# EAGLE schematic Relay Board (EAGLE 7.2.0)
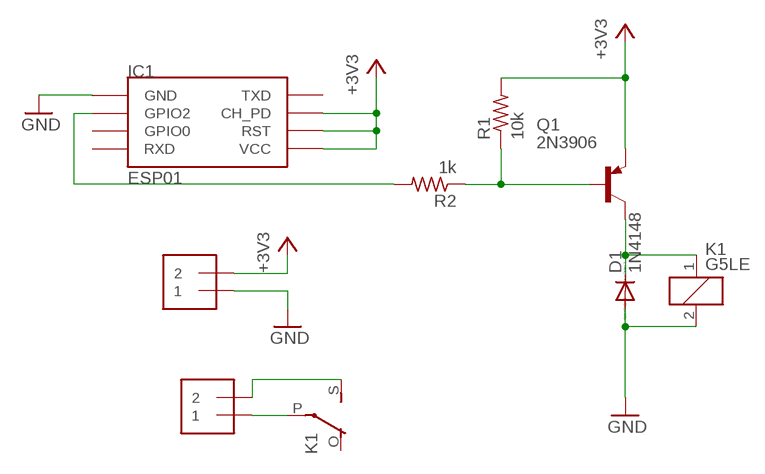
[diagram p0: schematic, sheet 1]

## Parts
D1  1N4148  1N4148DO35-7  [DO35-7]
IC1  ESP01  [ESP01]
J1  1X2-3.5MM  [1X2-3.5MM]
J2  1X2-3.5MM  [1X2-3.5MM]
K1  G5LE  [G5LE]
Q1  2N3906  [TO92]
R1  10k  R-US_0207/10  [0207/10]
R2  1k  R-US_0207/10  [0207/10]

## Nets
+3V3: IC1.CH_PD IC1.RST IC1.VCC J2.2 Q1.3(E) R1.2
GND: D1.A IC1.GND J2.1 K1.2
GPIO2: IC1.GPIO2 R2.2
N$1: Q1.2(B) R1.1 R2.1
N$2: D1.C K1.1 Q1.1(C)
N$3: J1.2 K1.S(2:S)
N$4: J1.1 K1.P(2:P)
Unconnected: IC1.GPIO0 IC1.RX(RXD) IC1.TX(TXD) K1.O(2:O)

## Library data of the parts
D1 = diode:1N4148: DIODE high speed (Philips)
IC1 = esp8266modules:ESP01: ESP8266 Wifi module 01
J1 J2 = adafruit:1X2: 3.5mm Terminal block http://www.ladyada.net/library/pcb/eaglelibrary.html
K1 = relay:G5LE: RELAY 1 x switch, 10 A/120 V AC, 8 A/30 V DC, Omron; OC_FARNELL: unknown; OC_NEWARK: unknown
Q1 = transistor-pnp:2N3906: PNP Transistor
R1 R2 = rcl:R-US_: RESISTOR, American symbol